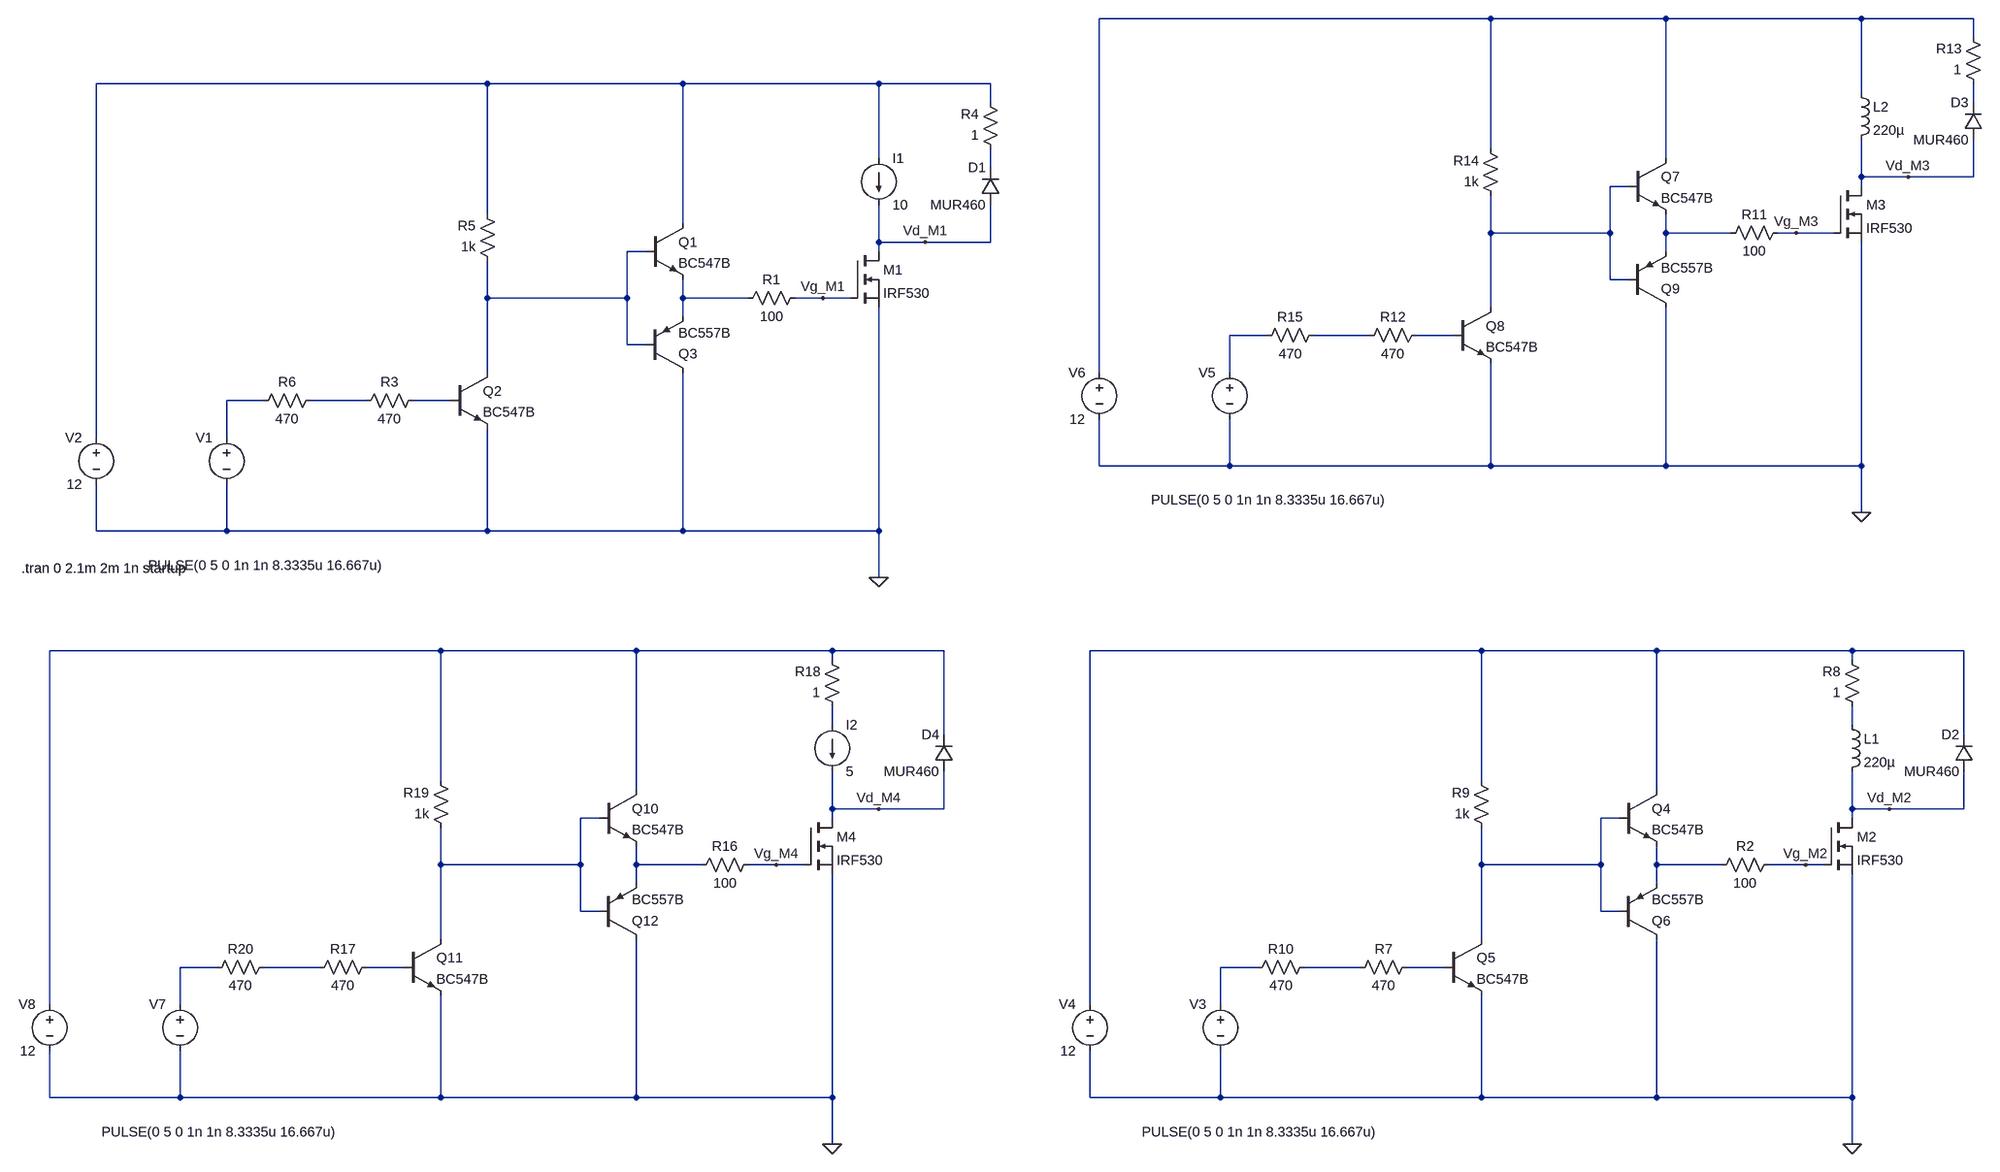
[diagram p0: schematic comparativa_resistencia.asc]
comparativa_resistencia.asc, the LTspice schematic file:
Version 4
SHEET 1 4596 1588
WIRE 2480 -464 1808 -464
WIRE 2816 -464 2480 -464
WIRE 3152 -464 2816 -464
WIRE 3344 -464 3152 -464
WIRE 3344 -432 3344 -464
WIRE 192 -352 -480 -352
WIRE 528 -352 192 -352
WIRE 864 -352 528 -352
WIRE 1056 -352 864 -352
WIRE 3152 -336 3152 -464
WIRE 1056 -320 1056 -352
WIRE 3344 -320 3344 -352
WIRE 2480 -240 2480 -464
WIRE 864 -224 864 -352
WIRE 2816 -224 2816 -464
WIRE 1056 -208 1056 -240
WIRE 3152 -192 3152 -256
WIRE 3232 -192 3152 -192
WIRE 3344 -192 3344 -256
WIRE 3344 -192 3232 -192
WIRE 2752 -176 2720 -176
WIRE 3152 -176 3152 -192
WIRE 192 -128 192 -352
WIRE 528 -112 528 -352
WIRE 2480 -96 2480 -160
WIRE 2720 -96 2720 -176
WIRE 2720 -96 2480 -96
WIRE 2816 -96 2816 -128
WIRE 2928 -96 2816 -96
WIRE 3040 -96 3008 -96
WIRE 3104 -96 3040 -96
WIRE 864 -80 864 -144
WIRE 944 -80 864 -80
WIRE 1056 -80 1056 -144
WIRE 1056 -80 944 -80
WIRE 464 -64 432 -64
WIRE 864 -64 864 -80
WIRE 2816 -64 2816 -96
WIRE 2720 -16 2720 -96
WIRE 2752 -16 2720 -16
WIRE 192 16 192 -48
WIRE 432 16 432 -64
WIRE 432 16 192 16
WIRE 528 16 528 -16
WIRE 640 16 528 16
WIRE 768 16 720 16
WIRE 816 16 768 16
WIRE 2480 32 2480 -96
WIRE 528 48 528 16
WIRE 2096 80 2032 80
WIRE 2272 80 2176 80
WIRE 2416 80 2352 80
WIRE 432 96 432 16
WIRE 464 96 432 96
WIRE 192 144 192 16
WIRE 1808 144 1808 -464
WIRE 2032 144 2032 80
WIRE -192 192 -256 192
WIRE -16 192 -112 192
WIRE 128 192 64 192
WIRE -480 256 -480 -352
WIRE -256 256 -256 192
WIRE 1808 304 1808 224
WIRE 2032 304 2032 224
WIRE 2032 304 1808 304
WIRE 2480 304 2480 128
WIRE 2480 304 2032 304
WIRE 2816 304 2816 32
WIRE 2816 304 2480 304
WIRE 3152 304 3152 -80
WIRE 3152 304 2816 304
WIRE 3152 384 3152 304
WIRE -480 416 -480 336
WIRE -256 416 -256 336
WIRE -256 416 -480 416
WIRE 192 416 192 240
WIRE 192 416 -256 416
WIRE 528 416 528 144
WIRE 528 416 192 416
WIRE 864 416 864 32
WIRE 864 416 528 416
WIRE 864 496 864 416
WIRE 112 720 -560 720
WIRE 448 720 112 720
WIRE 784 720 448 720
WIRE 976 720 784 720
WIRE 2464 720 1792 720
WIRE 2800 720 2464 720
WIRE 3136 720 2800 720
WIRE 3328 720 3136 720
WIRE 784 736 784 720
WIRE 3136 736 3136 720
WIRE 784 848 784 816
WIRE 3136 848 3136 816
WIRE 976 864 976 720
WIRE 3328 864 3328 720
WIRE 112 944 112 720
WIRE 2464 944 2464 720
WIRE 448 960 448 720
WIRE 2800 960 2800 720
WIRE 784 992 784 928
WIRE 864 992 784 992
WIRE 976 992 976 928
WIRE 976 992 864 992
WIRE 3136 992 3136 928
WIRE 3200 992 3136 992
WIRE 3328 992 3328 928
WIRE 3328 992 3200 992
WIRE 384 1008 352 1008
WIRE 784 1008 784 992
WIRE 2736 1008 2704 1008
WIRE 3136 1008 3136 992
WIRE 112 1088 112 1024
WIRE 352 1088 352 1008
WIRE 352 1088 112 1088
WIRE 448 1088 448 1056
WIRE 560 1088 448 1088
WIRE 688 1088 640 1088
WIRE 736 1088 688 1088
WIRE 2464 1088 2464 1024
WIRE 2704 1088 2704 1008
WIRE 2704 1088 2464 1088
WIRE 2800 1088 2800 1056
WIRE 2912 1088 2800 1088
WIRE 3056 1088 2992 1088
WIRE 3088 1088 3056 1088
WIRE 448 1120 448 1088
WIRE 2800 1120 2800 1088
WIRE 352 1168 352 1088
WIRE 384 1168 352 1168
WIRE 2704 1168 2704 1088
WIRE 2736 1168 2704 1168
WIRE 112 1216 112 1088
WIRE 2464 1216 2464 1088
WIRE -272 1264 -336 1264
WIRE -96 1264 -192 1264
WIRE 48 1264 -16 1264
WIRE 2080 1264 2016 1264
WIRE 2256 1264 2160 1264
WIRE 2400 1264 2336 1264
WIRE -560 1328 -560 720
WIRE -336 1328 -336 1264
WIRE 1792 1328 1792 720
WIRE 2016 1328 2016 1264
WIRE -560 1488 -560 1408
WIRE -336 1488 -336 1408
WIRE -336 1488 -560 1488
WIRE 112 1488 112 1312
WIRE 112 1488 -336 1488
WIRE 448 1488 448 1216
WIRE 448 1488 112 1488
WIRE 784 1488 784 1104
WIRE 784 1488 448 1488
WIRE 1792 1488 1792 1408
WIRE 2016 1488 2016 1408
WIRE 2016 1488 1792 1488
WIRE 2464 1488 2464 1312
WIRE 2464 1488 2016 1488
WIRE 2800 1488 2800 1216
WIRE 2800 1488 2464 1488
WIRE 3136 1488 3136 1104
WIRE 3136 1488 2800 1488
WIRE 784 1568 784 1488
WIRE 3136 1568 3136 1488
FLAG 864 496 0
FLAG 3136 1568 0
FLAG 3152 384 0
FLAG 784 1568 0
FLAG 3232 -192 Vd_M3
FLAG 3040 -96 Vg_M3
FLAG 3200 992 Vd_M2
FLAG 3056 1088 Vg_M2
FLAG 688 1088 Vg_M4
FLAG 864 992 Vd_M4
FLAG 944 -80 Vd_M1
FLAG 768 16 Vg_M1
SYMBOL npn 464 -112 R0
SYMATTR InstName Q1
SYMATTR Value BC547B
SYMBOL npn 128 144 R0
SYMATTR InstName Q2
SYMATTR Value BC547B
SYMBOL pnp 464 144 M180
SYMATTR InstName Q3
SYMATTR Value BC557B
SYMBOL nmos 816 -64 R0
SYMATTR InstName M1
SYMATTR Value IRF530
SYMBOL diode 1072 -144 R180
WINDOW 0 24 64 Left 2
WINDOW 3 24 0 Left 2
SYMATTR InstName D1
SYMATTR Value MUR460
SYMBOL res 736 0 R90
WINDOW 0 0 56 VBottom 2
WINDOW 3 32 56 VTop 2
SYMATTR InstName R1
SYMATTR Value 100
SYMBOL res 80 176 R90
WINDOW 0 0 56 VBottom 2
WINDOW 3 32 56 VTop 2
SYMATTR InstName R3
SYMATTR Value 470
SYMBOL res 1072 -224 R180
WINDOW 0 36 76 Left 2
WINDOW 3 36 40 Left 2
SYMATTR InstName R4
SYMATTR Value 1
SYMBOL res 208 -32 R180
WINDOW 0 36 76 Left 2
WINDOW 3 36 40 Left 2
SYMATTR InstName R5
SYMATTR Value 1k
SYMBOL res -208 208 R270
WINDOW 0 32 56 VTop 2
WINDOW 3 0 56 VBottom 2
SYMATTR InstName R6
SYMATTR Value 470
SYMBOL voltage -256 240 M0
WINDOW 3 -270 235 Left 2
WINDOW 123 0 0 Left 0
WINDOW 39 0 0 Left 0
SYMATTR Value PULSE(0 5 0 1n 1n 8.3335u 16.667u)
SYMATTR InstName V1
SYMBOL voltage -480 240 M0
WINDOW 123 0 0 Left 0
WINDOW 39 0 0 Left 0
SYMATTR InstName V2
SYMATTR Value 12
SYMBOL current 864 -224 R0
WINDOW 123 0 0 Left 0
WINDOW 39 0 0 Left 0
SYMATTR InstName I1
SYMATTR Value 10
SYMBOL npn 2736 960 R0
SYMATTR InstName Q4
SYMATTR Value BC547B
SYMBOL npn 2400 1216 R0
SYMATTR InstName Q5
SYMATTR Value BC547B
SYMBOL pnp 2736 1216 M180
SYMATTR InstName Q6
SYMATTR Value BC557B
SYMBOL nmos 3088 1008 R0
SYMATTR InstName M2
SYMATTR Value IRF530
SYMBOL diode 3344 928 R180
WINDOW 0 24 64 Left 2
WINDOW 3 24 0 Left 2
SYMATTR InstName D2
SYMATTR Value MUR460
SYMBOL res 3008 1072 R90
WINDOW 0 0 56 VBottom 2
WINDOW 3 32 56 VTop 2
SYMATTR InstName R2
SYMATTR Value 100
SYMBOL res 2352 1248 R90
WINDOW 0 0 56 VBottom 2
WINDOW 3 32 56 VTop 2
SYMATTR InstName R7
SYMATTR Value 470
SYMBOL res 3152 832 R180
WINDOW 0 36 76 Left 2
WINDOW 3 36 40 Left 2
SYMATTR InstName R8
SYMATTR Value 1
SYMBOL res 2480 1040 R180
WINDOW 0 36 76 Left 2
WINDOW 3 36 40 Left 2
SYMATTR InstName R9
SYMATTR Value 1k
SYMBOL res 2064 1280 R270
WINDOW 0 32 56 VTop 2
WINDOW 3 0 56 VBottom 2
SYMATTR InstName R10
SYMATTR Value 470
SYMBOL voltage 2016 1312 M0
WINDOW 3 -270 235 Left 2
WINDOW 123 0 0 Left 0
WINDOW 39 0 0 Left 0
SYMATTR Value PULSE(0 5 0 1n 1n 8.3335u 16.667u)
SYMATTR InstName V3
SYMBOL voltage 1792 1312 M0
WINDOW 123 0 0 Left 0
WINDOW 39 0 0 Left 0
SYMATTR InstName V4
SYMATTR Value 12
SYMBOL ind 3120 832 R0
SYMATTR InstName L1
SYMATTR Value 220µ
SYMBOL npn 2752 -224 R0
SYMATTR InstName Q7
SYMATTR Value BC547B
SYMBOL npn 2416 32 R0
SYMATTR InstName Q8
SYMATTR Value BC547B
SYMBOL pnp 2752 32 M180
SYMATTR InstName Q9
SYMATTR Value BC557B
SYMBOL nmos 3104 -176 R0
SYMATTR InstName M3
SYMATTR Value IRF530
SYMBOL diode 3360 -256 R180
WINDOW 0 24 64 Left 2
WINDOW 3 24 0 Left 2
SYMATTR InstName D3
SYMATTR Value MUR460
SYMBOL res 3024 -112 R90
WINDOW 0 0 56 VBottom 2
WINDOW 3 32 56 VTop 2
SYMATTR InstName R11
SYMATTR Value 100
SYMBOL res 2368 64 R90
WINDOW 0 0 56 VBottom 2
WINDOW 3 32 56 VTop 2
SYMATTR InstName R12
SYMATTR Value 470
SYMBOL res 3360 -336 R180
WINDOW 0 36 76 Left 2
WINDOW 3 36 40 Left 2
SYMATTR InstName R13
SYMATTR Value 1
SYMBOL res 2496 -144 R180
WINDOW 0 36 76 Left 2
WINDOW 3 36 40 Left 2
SYMATTR InstName R14
SYMATTR Value 1k
SYMBOL res 2080 96 R270
WINDOW 0 32 56 VTop 2
WINDOW 3 0 56 VBottom 2
SYMATTR InstName R15
SYMATTR Value 470
SYMBOL voltage 2032 128 M0
WINDOW 3 -270 235 Left 2
WINDOW 123 0 0 Left 0
WINDOW 39 0 0 Left 0
SYMATTR Value PULSE(0 5 0 1n 1n 8.3335u 16.667u)
SYMATTR InstName V5
SYMBOL voltage 1808 128 M0
WINDOW 123 0 0 Left 0
WINDOW 39 0 0 Left 0
SYMATTR InstName V6
SYMATTR Value 12
SYMBOL ind 3136 -352 R0
SYMATTR InstName L2
SYMATTR Value 220µ
SYMBOL npn 384 960 R0
SYMATTR InstName Q10
SYMATTR Value BC547B
SYMBOL npn 48 1216 R0
SYMATTR InstName Q11
SYMATTR Value BC547B
SYMBOL pnp 384 1216 M180
SYMATTR InstName Q12
SYMATTR Value BC557B
SYMBOL nmos 736 1008 R0
SYMATTR InstName M4
SYMATTR Value IRF530
SYMBOL diode 992 928 R180
WINDOW 0 24 64 Left 2
WINDOW 3 24 0 Left 2
SYMATTR InstName D4
SYMATTR Value MUR460
SYMBOL res 656 1072 R90
WINDOW 0 0 56 VBottom 2
WINDOW 3 32 56 VTop 2
SYMATTR InstName R16
SYMATTR Value 100
SYMBOL res 0 1248 R90
WINDOW 0 0 56 VBottom 2
WINDOW 3 32 56 VTop 2
SYMATTR InstName R17
SYMATTR Value 470
SYMBOL res 800 832 R180
WINDOW 0 36 76 Left 2
WINDOW 3 36 40 Left 2
SYMATTR InstName R18
SYMATTR Value 1
SYMBOL res 128 1040 R180
WINDOW 0 36 76 Left 2
WINDOW 3 36 40 Left 2
SYMATTR InstName R19
SYMATTR Value 1k
SYMBOL res -288 1280 R270
WINDOW 0 32 56 VTop 2
WINDOW 3 0 56 VBottom 2
SYMATTR InstName R20
SYMATTR Value 470
SYMBOL voltage -336 1312 M0
WINDOW 3 -270 235 Left 2
WINDOW 123 0 0 Left 0
WINDOW 39 0 0 Left 0
SYMATTR Value PULSE(0 5 0 1n 1n 8.3335u 16.667u)
SYMATTR InstName V7
SYMBOL voltage -560 1312 M0
WINDOW 123 0 0 Left 0
WINDOW 39 0 0 Left 0
SYMATTR InstName V8
SYMATTR Value 12
SYMBOL current 784 848 R0
WINDOW 123 0 0 Left 0
WINDOW 39 0 0 Left 0
SYMATTR InstName I2
SYMATTR Value 5
TEXT -608 480 Left 2 !.tran 0 2.1m 2m 1n startup

The netlist it stands for:
* comparativa_resistencia.asc
Q1 N002 N007 N008 0 BC547B
Q2 N007 N014 0 0 BC547B
Q3 0 N007 N008 0 BC557B
M1 Vd_M1 Vg_M1 0 0 IRF530
D1 Vd_M1 N004 MUR460
R1 Vg_M1 N008 100
R3 N014 N013 470
R4 N004 N002 1
R5 N007 N002 1k
R6 N012 N013 470
V1 N012 0 PULSE(0 5 0 1n 1n 8.3335u 16.667u)
V2 N002 0 12
I1 N002 Vd_M1 10
Q4 N016 N020 N022 0 BC547B
Q5 N020 N028 0 0 BC547B
Q6 0 N020 N022 0 BC557B
M2 Vd_M2 Vg_M2 0 0 IRF530
D2 Vd_M2 N016 MUR460
R2 Vg_M2 N022 100
R7 N028 N027 470
R8 N018 N016 1
R9 N020 N016 1k
R10 N026 N027 470
V3 N026 0 PULSE(0 5 0 1n 1n 8.3335u 16.667u)
V4 N016 0 12
L1 N018 Vd_M2 220µ
Q7 N001 N005 N006 0 BC547B
Q8 N005 N011 0 0 BC547B
Q9 0 N005 N006 0 BC557B
M3 Vd_M3 Vg_M3 0 0 IRF530
D3 Vd_M3 N003 MUR460
R11 Vg_M3 N006 100
R12 N011 N010 470
R13 N003 N001 1
R14 N005 N001 1k
R15 N009 N010 470
V5 N009 0 PULSE(0 5 0 1n 1n 8.3335u 16.667u)
V6 N001 0 12
L2 N001 Vd_M3 220µ
Q10 N015 N019 N021 0 BC547B
Q11 N019 N025 0 0 BC547B
Q12 0 N019 N021 0 BC557B
M4 Vd_M4 Vg_M4 0 0 IRF530
D4 Vd_M4 N015 MUR460
R16 Vg_M4 N021 100
R17 N025 N024 470
R18 N017 N015 1
R19 N019 N015 1k
R20 N023 N024 470
V7 N023 0 PULSE(0 5 0 1n 1n 8.3335u 16.667u)
V8 N015 0 12
I2 N017 Vd_M4 5
.model D D
.lib standard.dio
.model NPN NPN
.model PNP PNP
.lib standard.bjt
.model NMOS NMOS
.model PMOS PMOS
.lib standard.mos
.tran 0 2.1m 2m 1n startup
.backanno
.end

* Results of the author's LTspice run, read from the files saved beside the schematic
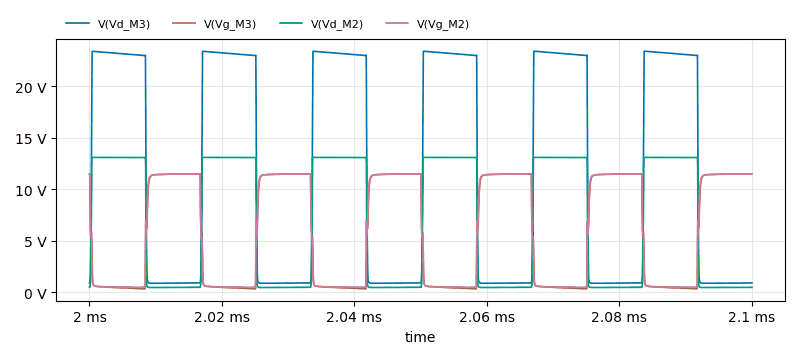
[diagram p1: Transient Analysis of comparativa_resistencia.asc, plotted from the saved traces]
* Transient Analysis, 1 run:
*   V(Vd_M3): min 875.9 mV, max 23.43 V, average 11.96 V, rms 16.29 V, last 904.8 mV
*   V(Vg_M3): min 332 mV, max 11.51 V, average 5.932 V, rms 8.004 V, last 11.51 V
*   V(Vd_M2): min 462.6 mV, max 13.11 V, average 6.736 V, rms 9.205 V, last 478.6 mV
*   V(Vg_M2): min 493.8 mV, max 11.51 V, average 5.967 V, rms 8.017 V, last 11.5 V